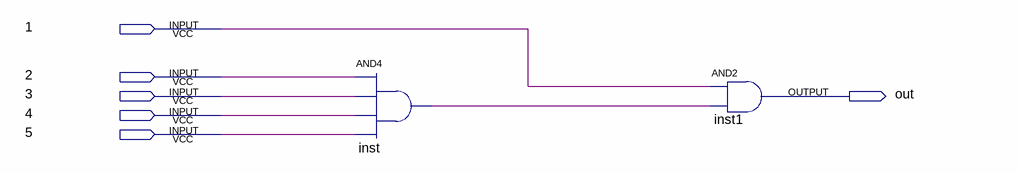
[diagram p0: schematic sheet]
// Quartus schematic AND5.bdf as structural Verilog: 2 symbols, 6 pins
module AND5 (
  input  \1 ,
  input  \2 ,
  input  \3 ,
  input  \4 ,
  input  \5 ,
  output out
);

  wire inst_out;

  and inst (inst_out, \2 , \3 , \4 , \5 );
  and inst1 (out, \1 , inst_out);
endmodule
